# EAGLE design comfort_board (EAGLE 7.2.0)
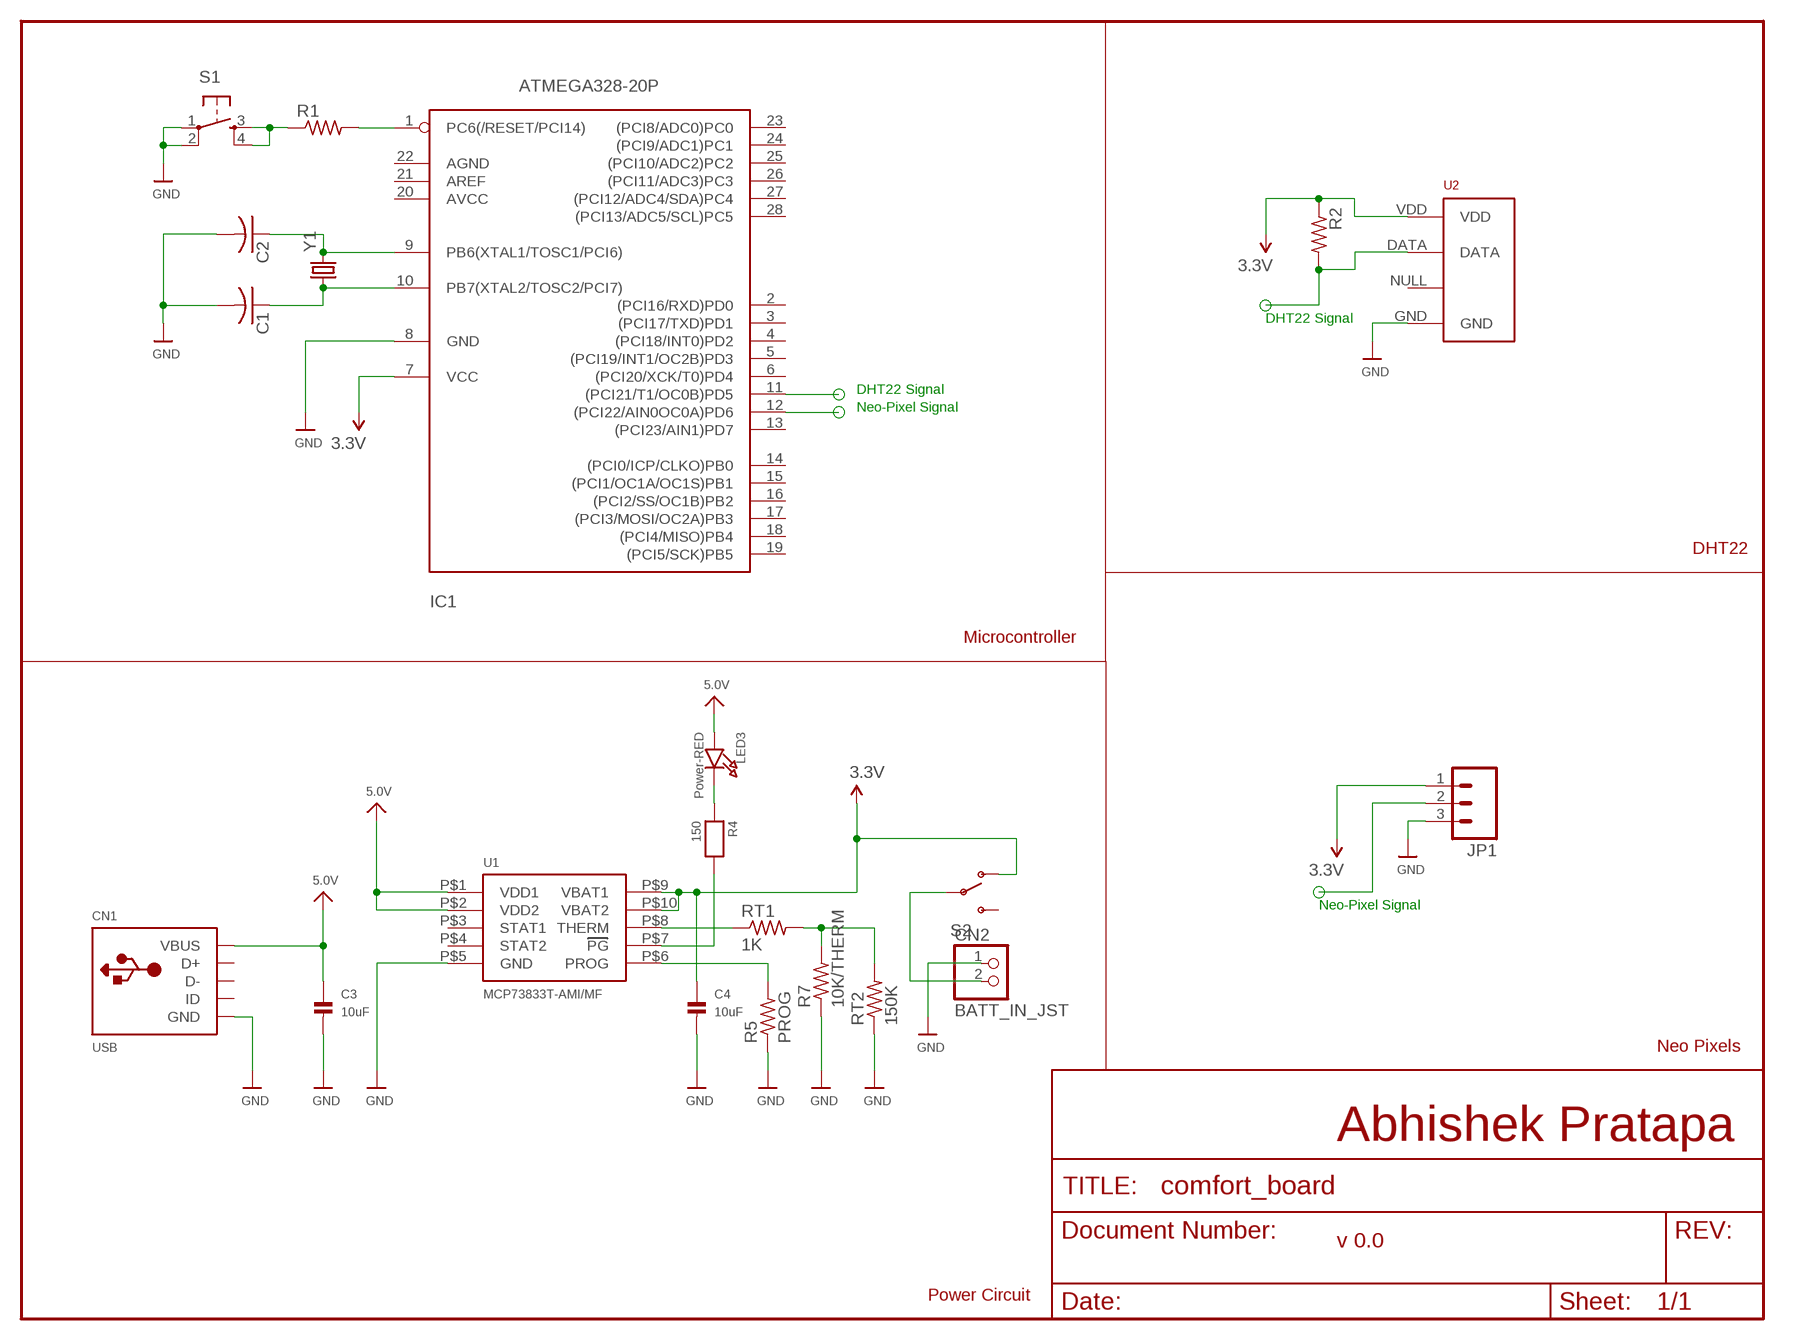
[diagram p0: schematic, sheet 1]

## Parts
C1  C-USC1206  [C1206]
C2  C-USC1206  [C1206]
C3  10uF  CAP_CERAMIC0805  [0805]
C4  10uF  CAP_CERAMIC0805  [0805]
CN1  USB  USBMINIBLARGE  [USB-MINIB_LARGER]
CN2  BATT_IN_JST  JST_2PIN  [JSTPH2]
IC1  ATMEGA328-20P  [DIL28-3]
JP1  M03PTH  [1X03]
LED3  Power-RED  LED0805  [CHIPLED_0805]
R1  R-US_M1206  [M1206]
R2  R-US_M1206  [M1206]
R4  150  RESISTOR0805  [0805]
R5  PROG  RESISTOR_DUAL  [0805-THM]
R7  10K/THERM  R-US_FLIPFLOP  [0805-THM]
RT1  1K  R-US_R0805  [R0805]
RT2  150K  R-US_R0805  [R0805]
S1  TAC_SWITCHPTH  [TACTILE-PTH]
S2  SWITCH-SPSTSMD2  [SWITCH-SPDT-SMD]
U1  MCP73833T-AMI/MF  MCP73833DFN  [DFN10_3X3MM]
U2  RHT03_DHT-22_AM2302RA  [RHT03_DHT-22/RA]
Y1  CRYSTALHC49US  [HC49US]

## Nets
3.3V: C4.1 IC1.7(VCC) JP1.1 R2.1 S2.1(O) U1.P$9(VBAT1) U1.P$10(VBAT2) U2.VDD
5.0V: C3.1 CN1.VBUS LED3.A U1.P$1(VDD1) U1.P$2(VDD2)
DHT22: IC1.11((PCI21/T1/OC0B)PD5) R2.2 U2.DATA
GND: C1.2 C2.2 C3.2 C4.2 CN1.GND CN2.1 IC1.8(GND) JP1.3 R5.1 R7.1 RT2.1 S1.1 S1.2 U1.P$5(GND) U2.GND
N$1: C2.1 IC1.9(PB6(XTAL1/TOSC1/PCI6)) Y1.2
N$2: C1.1 IC1.10(PB7(XTAL2/TOSC2/PCI7)) Y1.1
N$4: R1.1 S1.3 S1.4
N$5: IC1.1(PC6(/RESET/PCI14)) R1.2
N$6: IC1.12((PCI22/AIN0OC0A)PD6) JP1.2
N$7: CN2.2 S2.2(P)
N$9: R4.2 U1.P$7(PG)
N$10: RT1.1 U1.P$8(THERM)
N$11: R7.2 RT1.2 RT2.2
N$12: LED3.C R4.1
N$16: R5.2 U1.P$6(PROG)
Unconnected: CN1.D+ CN1.D- CN1.ID IC1.2((PCI16/RXD)PD0) IC1.3((PCI17/TXD)PD1) IC1.4((PCI18/INT0)PD2) IC1.5((PCI19/INT1/OC2B)PD3) IC1.6((PCI20/XCK/T0)PD4) IC1.13((PCI23/AIN1)PD7) IC1.14((PCI0/ICP/CLKO)PB0) IC1.15((PCI1/OC1A/OC1S)PB1) IC1.16((PCI2/SS/OC1B)PB2) IC1.17((PCI3/MOSI/OC2A)PB3) IC1.18((PCI4/MISO)PB4) IC1.19((PCI5/SCK)PB5) IC1.20(AVCC) IC1.21(AREF) IC1.22(AGND) IC1.23((PCI8/ADC0)PC0) IC1.24((PCI9/ADC1)PC1) IC1.25((PCI10/ADC2)PC2) IC1.26((PCI11/ADC3)PC3) IC1.27((PCI12/ADC4/SDA)PC4) IC1.28((PCI13/ADC5/SCL)PC5) S2.3(S) U1.P$3(STAT1) U1.P$4(STAT2) U2.NULL

## Notes on the sheet
- DHT22 Signal
- DHT22 Signal
- Neo-Pixel Signal
- DHT22
- Microcontroller
- Neo-Pixel Signal
- Neo Pixels
- Abhishek Pratapa
- v 0.0
- Power Circuit

## Library data of the parts
C1 C2 = rcl:C-US: CAPACITOR, American symbol
C3 C4 = microbuilder:CAP_CERAMIC: Ceramic Capacitors 0402 - 0402 Surface Mount Capacitors 16pF 50V 5% [Digikey: 445-4899-2-ND] 18pF 50V 5% [Digikey: 490-1281-2-ND] 22pF 50V 5% [Digikey: 490-1283-2-ND] 68pF 50V 5% [Digikey: 490-1289-2-ND] 0.1uF 10V 10% [Digikey: 490-1318-2-ND] 1.0uF 6.3V 10% [Digikey: 490-1320-2-ND] 0603 - 0603 Surface Mount Capacitors 16 pF 50V 5% [Digikey: 445-5051-2-ND] 22 pF 50V [Digikey: PCC220ACVTR-ND] 33 pF 50V 5% [Digikey: 490-1415-1-ND] 56pF 50V 5% [Digikey: 490-1421-1-ND] 220pF 50V 5% [Digikey: 445-1285-1-ND] 680 pF 50V 2200 pF 50V 5% C0G [Digikey: 445-1297-1-ND] 5600 pF 100V 5% X7R [Digikey: 478-3711-1-ND] 0.1 µF 25V 10% [Digikey: PCC2277TR-ND] 0.22 µF 16V 10% X7R [Digikey: 445-1318-1-ND] 1.0 µF 25V 10% [Digikey: 445-5146-2-ND] 0603 - RF Specific 3pF 250V +/-0.1pF RF [Digikey: 712-1347-1-ND] 18 pF 250V 5% [Digikey: 478-3505-1-ND or 712-1322-1-ND] 56 pF 250V 5% C0G RF [Digikey: 490-4867-1-ND] 68 pF 250V RF [Digikey: 490-4868-1-ND] 0805 - 0805 Surface Mount Capacitors 220 pF 250V 2% RF Ceramic Capacitor [Digikey: 712-1398-1-ND] 1000 pF 50V 2% NP0 Ceramic Capacitor [Digikey: 478-3760-1-ND] 0.1 µF 25V 10% Ceramic Capacitor [Digikey: PCC1828TR-ND] 1.0 µF 16V 10% Ceramic Capacitor[Digikey: 490-1691-2-ND] 10.0 µF 10V 10% Ceramic Capacitor[Digikey: 709-1228-1-ND] 10.0 uF 16V 10% Ceramic Capacitor [Digikey: 478-5165-2-ND] 47 uF 6.3V 20% Ceramic Capacitor [Digikey: 399-5506-1-ND] 1206 - 1206 Surface Mount Capacitors 47uF 10V 20% Ceramic Capacitor [Digikey: 399-5508-1-ND]
CN1 = microbuilder:USB: USB Connectors USBMINIB - Surface Mount Female Mini-B USB Connector 4UConnector: 06564
CN2 = microbuilder:JST_2PIN: JST 2-Pin Right-Angle Connector PH-Series - 4UConnector: 17311 SH-Series - 4UConnector: 07278
IC1 = atmega328:ATMEGA328*P: MICROCONTROLLER 32 kBytes FLASH 2 kBytes SRAM 1 kBytes EEPROM USART 8-channel 10 bit ADC
JP1 = SparkFun:M03: Header 3 Standard 3-pin 0.1" header. Use with straight break away headers (SKU : PRT-00116), right angle break away headers (PRT-00553), swiss pins (PRT-00743), machine pins (PRT-00117), and female headers (PRT-00115). Molex polarized connector foot print use with SKU : PRT-08232 with associated crimp pins and housings.
LED3 = microbuilder:LED: LED 0603 - 0603 Surface Mount Package 2mA: Green LED - Low Power (3.9mcd, 2ma, 1.7Vf) - Digikey: 475-2709-2-ND Orange LED - Low Power (9.8mcd, 2ma, 1.8Vf) - Digikey: 475-1194-2-ND Red LED - Low Power (5mcd, 2ma, 1.8Vf) - Digikey: 475-1195-2-ND Yellow LED - Low Power (7mcd, 2ma, 1.8Vf) - Digikey: 475-1196-2-ND 5mA: Blue LED - Low Power (17mcd, 5ma, 2.9Vf) - Digikey: LNJ937W8CRACT-ND 0805 - 0805 Surface Mount Package 2mA: Red LED (8.8mcd, 2mA, 1.8Vf, Clear) - Low Power [Digikey: 475-2510-1-ND] Green LED (5mcd, 2mA, 1.8Vf, Clear) - Low Power [Digikey: 475-2730-1-ND] Yellow LED (11.3mcd, 2mA, 1.8Vf, Clear) - Low Power [Digikey: 475-2555-1-ND] 20mA: Red LED (104mcd, 20mA, Diffused) - LS R976 [Digikey: 475-1278-6-ND] Red LED (12mcd, 20mA, 2.0Vf, Clear) - APT2012EC [Digikey: 754-1128-1-ND] Green LED (15mcd, 20mA, 2.2Vf, Clear) - APT2012GC [Digikey: 754-1131-1-ND] Orange LED (160mcd, 20mA, 2.1Vf, Clear) - APT2012SECK [Digikey: 754-1130-1-ND] 1206 - 1206 Surface Mount Package Green LED (26mcd, 20mA, Diffused) - LG N971 [Digikey: 475-1407-6-ND] Red LED (15mcd, 20mA, Diffused) - LH N974 [Digikey: 475-1416-6-ND]
R1 R7 RT1 RT2 = adafruit:R-US_: RESISTOR, American symbol
R2 = resistor:R-US_: RESISTOR, American symbol
R4 = microbuilder:RESISTOR: Resistors 0402 - 0402 Surface Mount Package 22 Ohm 1% 1/16W [Digikey: 311-22.0LRTR-ND] 33 Ohm 5% 1/16W 1.0K 5% 1/16W 1.5K 5% 1/16W 2.0K 1% 1/16W 10.0K 1% 1/16W [Digikey: 311-10.0KLRTR-ND] 10.0K 5% 1/16W [Digikey: RMCF0402JT10K0TR-ND] 12.1K 1% 1/16W [Digikey: 311-22.0LRTR-ND] 100.0K 5% 1/16W 0603 - 0603 Surface Mount Package 0 Ohm 1/10 Watt 1% Resistor 15 Ohm 1/10 Watt 1% Resistor 33 Ohm 1/10 Watt 1% Resistor 49.9 Ohm 1/10 Watt 1% Resistor 100 Ohm 1/10 Watt 1% Resistor 150 Ohm 1/10 Watt 1% Resistor 240 Ohm 1/10 Watt 1% Resistor 390 Ohm 1/10 Watt 1% Resistor 560 Ohm 1/10 Watt 1% Resistor 680 Ohm 1/10 Watt 1% Resistor 750 Ohm 1/10 Watt 1% Resistor 1.0K Ohm 1/10 Watt 1% Resistor 1.5K Ohm 1/10 Watt 1% Resistor 2.0K Ohm 1/10 Watt 1% Resistor 2.2K Ohm 1/10 Watt 1% Resistor 3.3K Ohm 1/10 Watt 1% Resistor 4.7K Ohm 1/10 Watt 1% Resistor 10.0K Ohm 1/10 Watt 1% Resistor 12.0K Ohm 1/10 Watt 1% Resistor 12.1K Ohm 1/10 Watt 1% Resistor 20.0K Ohm 1/10 Watt 1% Resistor 33.0K Ohm 1/10 Watt 1% Resistor 100.0K Ohm 1/10 Watt 1% Resistor 0805 - 0805 Surface Mount Package 0 Ohm 1/8 Watt 1% Resistor 33 Ohm 1/8 Watt 1% Resistor 100 Ohm 1/8 Watt 1% Resistor 150 Ohm 1/8 Watt 1% Resistor 200 Ohm 1/8 Watt 1% Resistor 240 Ohm 1/8 Watt 1% Resistor 330 Ohm 1/8 Watt 1% Resistor 390 Ohm 1/8 Watt 1% Resistor 470 Ohm 1/8 Watt 1% Resistor 1.0K Ohm 1/8 Watt 1% Resistor 1.5K Ohm 1/8 Watt 1% Resistor 2.0K Ohm 1/8 Watt 1% Resistor 4.7K Ohm 1/8 Watt 1% Resistor 5.1K Ohm 1/8 Watt 1% Resistor 5.6K Ohm 1/8 Watt 1% Resistor 10.0K Ohm 1/8 Watt 1% Resistor 22.0K Ohm 1/8 Watt 1% Resistor 33.0K Ohm 1/8 Watt 1% Resistor 100K Ohm 1/8 Watt 1% Resistor 1206 - 1206 Surface Mount Package
R5 = microbuilder:RESISTOR_DUAL: Flip Flop resistor An 0805 resistor inside a standard 1/4W 5% resistor. Makes for easy mods Footprint taken from the Adafruit Industries Eagle Library.
S1 = SparkFun:TAC_SWITCH: Momentary Switch Button commonly used for reset or general input. Spark Fun Electronics SKU : COM-00097
S2 = SparkFun:SWITCH-SPST: SPST Switch Simple slide switch. Spark Fun Electronics SKU : COM-00102
U1 = microbuilder:MCP73833: Lithium-Polymer/Lithium-Ion Battery Charger [Part No.] Microchip MCP73833 MSOP10 (tube only): Digikey: MCP73833T-AMI/UN or MCP73833-FCI/UN-ND Mouser: 579-MCP73833-AMI/UN DFN10 (tape): Digikey: Note Chips ending in 'AMI' have no timer, and chips ending in 'FCI' have a 6-hour timer that will end the charge sequence after 6 horus regqrdless of current charge level.
U2 = RHT03_DHT-22_AM2302:RHT03_DHT-22_AM2302: RHT03 / DHT-22 / AM2302 Packages and symbol for the RHT03 / DHT-22 relative humidity and temperature sensor. Note: The AM2302 is a wired version of the DHT-22 which typically requires less clearance and is thus provided as a separate package.; PROD_ID: SEN-10167
Y1 = SparkFun-FreqCtrl:CRYSTAL: Various standard crystals. Proven footprints.

## Net classes
0 default: width 0.508 mm, drill 0.254 mm, clearance 0.254 mm

## Board
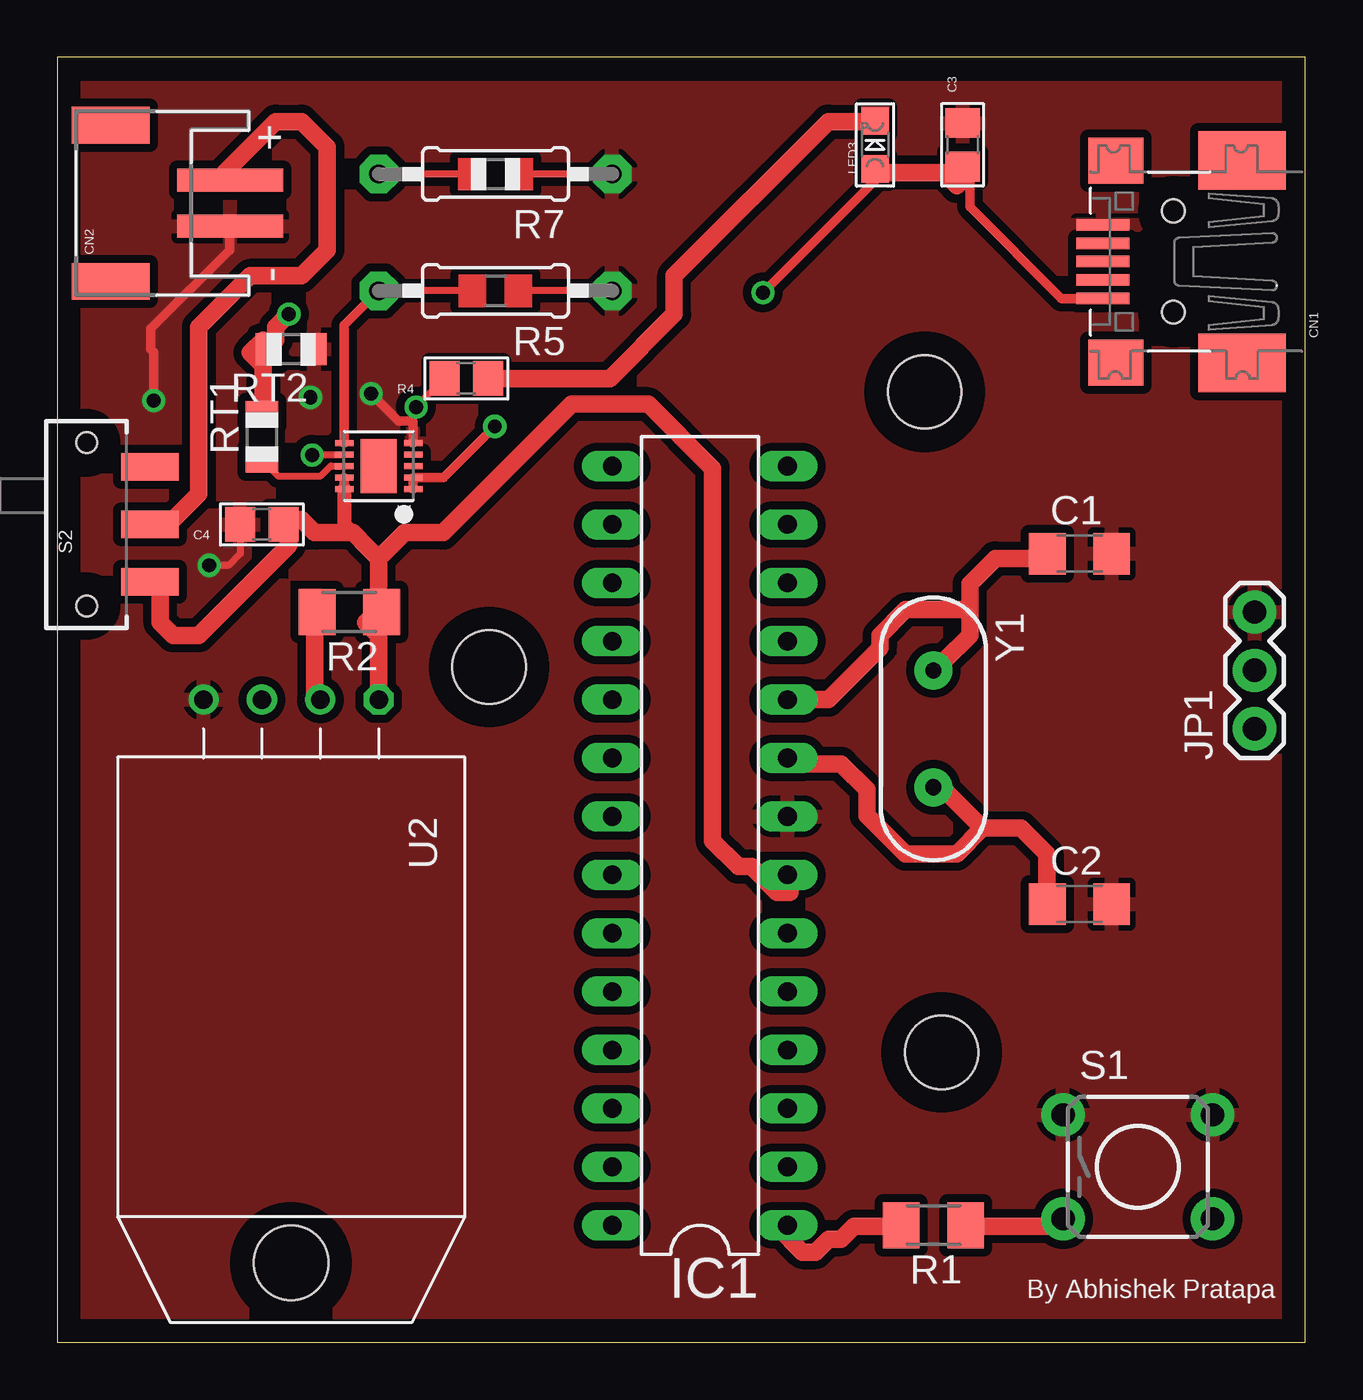
[diagram p1: board, top side]
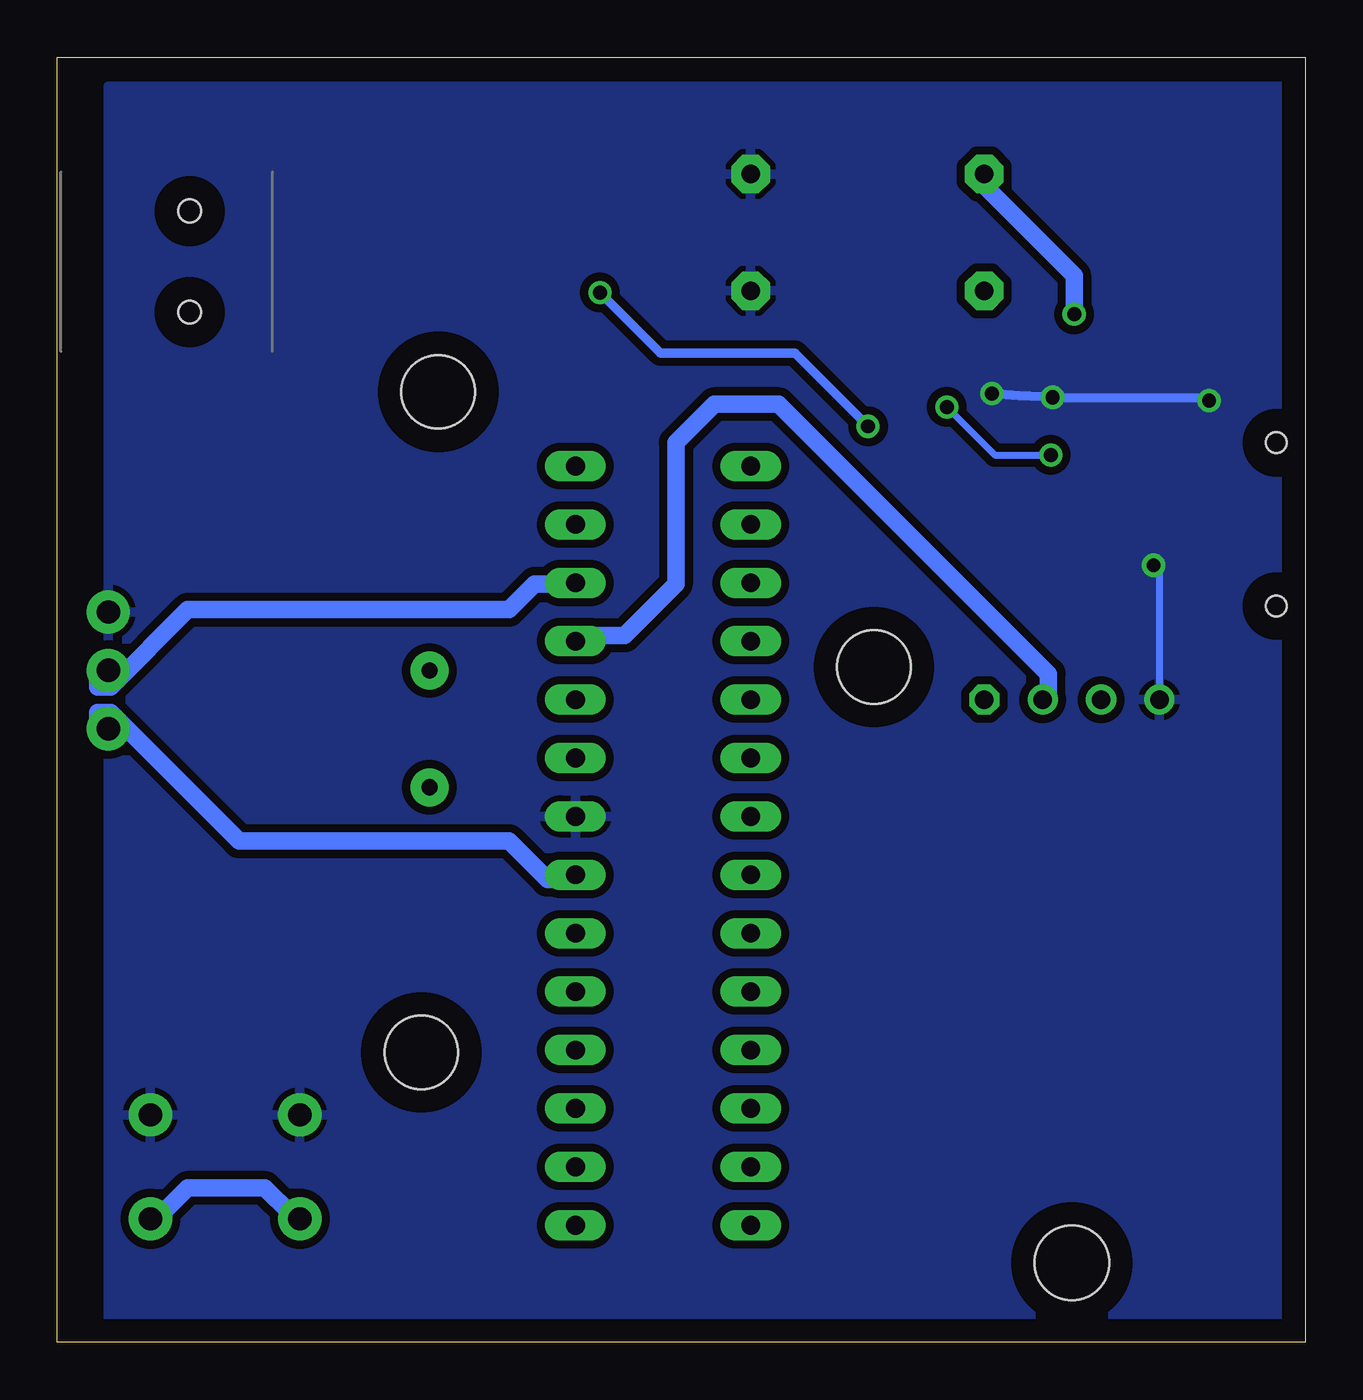
[diagram p2: board, bottom side, seen from below]

Size 54.28 x 55.87 mm. Coordinates in mm from the lower left corner, seen from the top.
Outline: 0,0 54.28,0 54.28,55.87 0,55.87 0,0
Copper layers (1*16): Top 0.035mm / dielectric 1.5mm / Bottom 0.035mm
Design rules "default": minimum track width 10mil, minimum drill 24mil, track to track 8mil, track to pad 8mil, pad to pad 8mil, via to via 8mil, smd to smd 8mil, copper to edge 40mil, drill to drill 8mil, minimum pad ring 10mil, minimum via ring 8mil, stop-mask expansion 4mil, vias tented up to drill 0mil, thermal gap 10mil
Holes 3.2 mm at 37.72,41.33 38.46,12.6 18.77,29.36

### Footprints (pad centres in the part's own frame; a part is rotated, then mirrored left to right if it is on the bottom)
C1206 = smd 1.6 x 1.8: 1 -1.4,0; 2 1.4,0
0805 = smd 1.3 x 1.5: 1 -0.95,0; 2 0.95,0
USB-MINIB_LARGER = smd 0.5 x 2.308: D+ 0,4.064; D- -0.8,4.064; GND 1.6,4.064; ID 0.8,4.064; VBUS -1.6,4.064 | smd 2.54 x 3.81: GND1 -4.4,-2; GND4 4.4,-2 | smd 2 x 2.4: GND2 -4.4,3.5; GND3 4.4,3.5 | hole 1: -2.2,1; 2.2,1
JSTPH2 = smd 1 x 4.6: 1 -1,-3.7; 2 1,-3.7 | smd 1.6 x 3.4: NC1 -3.4,1.5; NC2 3.4,1.5
DIL28-3 = drill 0.813 long: 1 -16.51,-3.81; 2 -13.97,-3.81; 3 -11.43,-3.81; 4 -8.89,-3.81; 5 -6.35,-3.81; 6 -3.81,-3.81; 7 -1.27,-3.81; 8 1.27,-3.81; 9 3.81,-3.81; 10 6.35,-3.81; 11 8.89,-3.81; 12 11.43,-3.81; 13 13.97,-3.81; 14 16.51,-3.81; 15 16.51,3.81; 16 13.97,3.81; 17 11.43,3.81; 18 8.89,3.81; 19 6.35,3.81; 20 3.81,3.81; 21 1.27,3.81; 22 -1.27,3.81; 23 -3.81,3.81; 24 -6.35,3.81; 25 -8.89,3.81; 26 -11.43,3.81; 27 -13.97,3.81; 28 -16.51,3.81
1X03 = drill 1.016 pad 1.88: 1 0,0; 2 2.54,0; 3 5.08,0
CHIPLED_0805 = smd 1.2 x 1.2: A 0,-1.05; C 0,1.05
M1206 = smd 1.6 x 2: 1 -1.4,0; 2 1.4,0
0805-THM = drill 0.813 pad 1.676 octagon: 1 -5.08,0; 2 5.08,0
R0805 = smd 1.1 x 1.4: 1 -1,0; 2 1,0
TACTILE-PTH = drill 1.016 pad 1.88: 1 -3.251,2.261; 2 3.251,2.261; 3 -3.251,-2.261; 4 3.251,-2.261
SWITCH-SPDT-SMD = smd 1.2 x 2.5: 1 -2.5,-2.75; 2 0,-2.75; 3 2.5,-2.75 | hole 0.9: -3.55,0; 3.55,0
DFN10_3X3MM = smd 2.35 x 1.58: GND 0,0 | smd 0.25 x 0.8: P$1 -1,-1.5; P$2 -0.5,-1.5; P$3 0,-1.5; P$4 0.5,-1.5; P$5 1,-1.5; P$6 1,1.5; P$7 0.5,1.5; P$8 0,1.5; P$9 -0.5,1.5; P$10 -1,1.5
RHT03_DHT-22/RA = drill 0.8: DATA -1.27,0; GND 3.81,0; NULL 1.27,0 | drill 0.8 octagon: VDD -3.81,0 | hole 3.25: 0,24.5
HC49US = drill 0.7 pad 1.651: 1 -2.54,0; 2 2.54,0

### Placement (x,y rotation side)
C1  44.45,34.29 0 top
C2  44.45,19.05 0 top
C3  39.37,52.07 90 top
C4  8.89,35.56 180 top
CN1  49.53,46.99 90 top
CN2  3.81,49.53 90 top
IC1  27.94,21.59 90 top
JP1  52.07,26.67 90 top
LED3  35.56,52.07 0 top
R1  38.1,5.08 180 top
R2  12.7,31.75 180 top
R4  17.78,41.91 180 top
R5  19.05,45.72 180 top
R7  19.05,50.8 180 top
RT1  8.89,39.37 90 top
RT2  10.16,43.18 180 top
S1  46.99,7.62 0 top
S2  1.27,35.56 90 top
U1  13.97,38.1 90 top
U2  10.16,27.94 180 top
Y1  38.1,26.67 270 top

### Tracks (layer width: path | path; a pad name or v marks a point on that pad's centre or on a via)
3.3V
  Top 0.406: U1.P$9 U1.P$10
  Top 0.61: U1.P$10 12.47,35.59 13.5,34.56
  Top 0.762: 13.97,34.09 13.5,34.56 12.85,35.2 11.18,35.2 10.62,35.76 10.06,35.76 C4.1 10.06,35.2 10.06,34.65 6.15,30.73 5.03,30.73 4.47,31.29 4.47,32.97 S2.1 | 13.97,31.85 13.97,34.09 | U2.VDD 13.97,30.73 13.41,31.29 13.97,31.85 | 13.97,31.85 R2.1 | 13.97,34.09 15.09,35.2 16.76,35.2 22.35,40.79 25.7,40.79 28.5,38 28.5,21.79 29.62,20.68 30.18,20.68 31.29,19.56 31.85,19.56 31.85,20.12 IC1.7
  Bottom 0.762: IC1.7 31.85,20.12 32.97,20.12 34.65,21.79 46.38,21.79 51.97,27.38 52.53,27.38 52.53,26.82 JP1.1
5.0V  (via drill 0.6)
  Top 0.406: 39.67,50.85 39.67,49.38 43.66,45.39 CN1.VBUS | CN1.VBUS | U1.P$1 U1.P$2 16.8,37.6 v19.02,39.83 | v30.68,45.64 35.56,50.52 LED3.A
  Top 0.762: LED3.A 35.76,50.85 38.56,50.85 39.12,50.29 39.67,50.85 C3.1
  Bottom 0.406: v19.02,39.83 22.2,43 28.04,43 v30.68,45.64
DHT22
  Top 0.762: R2.2 11.18,31.29 11.18,27.94 U2.DATA
  Bottom 0.762: IC1.11 31.29,30.73 29.62,30.73 27.38,32.97 27.38,39.12 25.7,40.79 22.91,40.79 11.18,29.06 11.18,27.94 U2.DATA
GND  (via drill 0.6)
  Top 0.305: C4.2 7.95,34.29 7.44,33.78 v6.6,33.78
  Top 0.406: CN2.1 7.49,48.51 7.49,47.5 4.06,44.07 4.06,43.18 4.19,43.05 v4.19,40.95 | v11,41.07 11.1,41.1 v11,41.1 | v13.64,41.25 14.83,40.06 15.42,40.06 15.47,40 U1.P$5
  Bottom 0.305: v6.6,33.78 6.35,33.53 U2.GND
  Bottom 0.406: v4.19,40.95 4.29,41.05 v11,41.07 | v11,41.1 12.45,41.17 v13.64,41.25
  pour Bottom: 0,0 0,54.61 52.07,54.61 52.07,0
  pour Top: 0,0 0,54.61 53.34,54.61 53.34,0
N$1
  Top 0.762: 40.23,22.35 41.91,22.35 43.03,21.23 43.03,19.56 C2.1 | 40.23,22.35 38.56,24.03 Y1.2 | 40.23,22.35 39.12,21.23 36.88,21.23 35.2,22.91 35.2,24.03 34.09,25.15 31.85,25.15 IC1.9
N$2
  Top 0.762: 39.67,31.85 39.67,30.73 38.56,29.62 Y1.1 | 39.67,31.85 39.67,32.97 40.79,34.09 43.03,34.09 C1.1 | IC1.10 33.53,27.94 35.76,30.18 35.76,30.73 36.88,31.85 39.67,31.85
N$4
  Top 0.762: R1.1 39.67,5.03 43.59,5.03 S1.3
  Bottom 0.762: S1.4 49.73,5.59 48.62,6.71 45.26,6.71 44.15,5.59 S1.3
N$5
  Top 0.762: R1.2 36.32,5.03 34.65,5.03 34.09,4.47 33.53,4.47 32.97,3.91 32.41,3.91 31.29,5.03 IC1.1
N$6
  Bottom 0.762: IC1.12 31.85,32.97 33.53,32.97 34.65,31.85 48.62,31.85 51.97,28.5 52.53,28.5 52.53,29.06 JP1.2
N$7
  Top 0.762: S2.2 4.47,35.76 5.03,35.76 6.15,36.88 6.15,44.15 8.38,46.38 10.62,46.38 11.73,47.5 11.73,51.97 10.62,53.09 9.5,53.09 7.26,50.85 CN2.2
N$9  (via drill 0.6)
  Top 0.305: R4.2 v15.6,40.68 v15.6,40.66 | v11.07,38.58 11.09,38.6 U1.P$7
  Bottom 0.305: v15.6,40.66 13.51,38.58 v11.07,38.58
N$10
  Top 0.305: RT1.1 9.59,37.67 11.46,37.67 11.89,38.1 U1.P$8
N$11  (via drill 0.61)
  Top 0.762: RT1.2 8.94,40.79 8.94,42.47 8.38,43.03 8.94,43.59 RT2.2 9.5,43.59 9.5,44.15 v10.06,44.7
  Bottom 0.762: v10.06,44.7 10.06,46.38 13.97,50.29 R7.2
N$12
  Top 0.762: R4.1 24.03,41.91 26.82,44.7 26.82,46.38 33.53,53.09 35.2,53.09 LED3.C
N$16
  Top 0.406: R5.2 12.47,44.22 U1.P$6

### Text on the board
tNames: By Abhishek Pratapa